# Altium schematic sheet universky-MCU.SchDoc
size A4
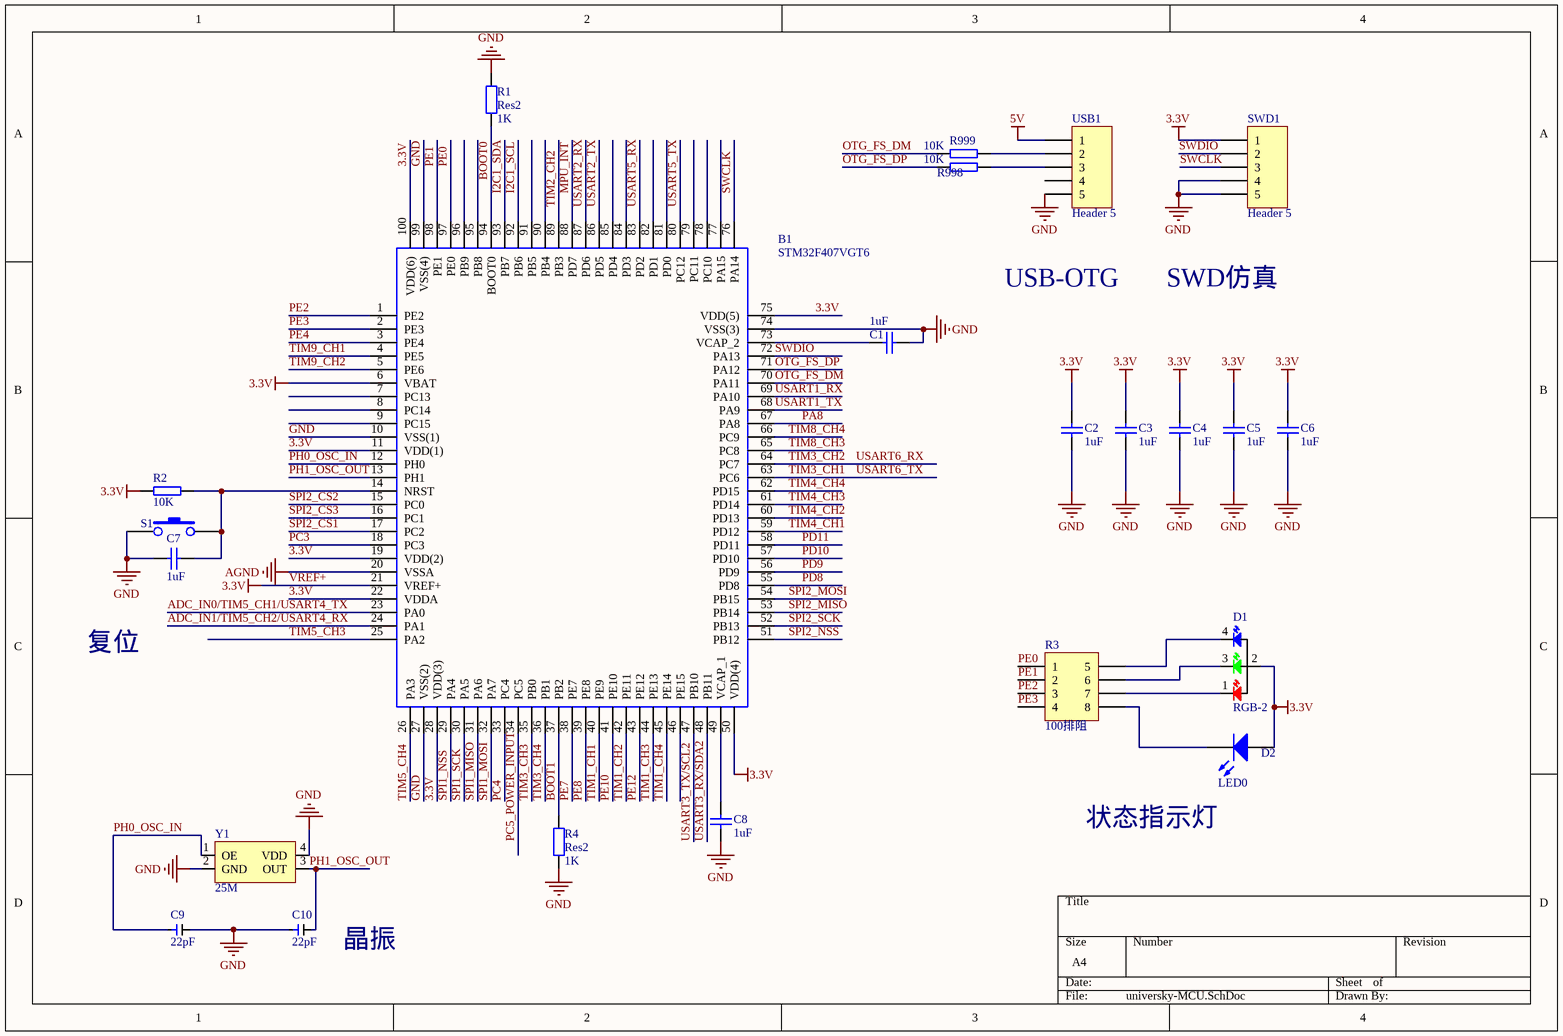
[diagram p0: universky-MCU.SchDoc]

## Parts
B1  STM32F407VGT6  [QFP50P1600X1600X160-100N]
C1  value 1uF  [0603_C]  (hidden comment: Cap)
C2  value 1uF  [0603_C]  (hidden comment: Cap)
C3  value 1uF  [0603_C]  (hidden comment: Cap)
C4  value 1uF  [0603_C]  (hidden comment: Cap)
C5  value 1uF  [0603_C]  (hidden comment: Cap)
C6  value 1uF  [0603_C]  (hidden comment: Cap)
C7  value 1uF  [0603_C]  (hidden comment: Cap)
C8  value 1uF  [0603_C]  (hidden comment: Cap)
C9  22pF  [0603_C]
C10  22pF  [0603_C]
D1  RGB-2  [RGB-2]
D2  LED0  [0603_LED]
R1  Res2  value 1K  [0603_R]
R2  RES_10K  [0603_R]  (value not drawn)
R3  100排阻  [HDR_R_4]
R4  Res2  value 1K  [0603_R]
R998  RES_10K  [0603_R]  (value not drawn)
R999  RES_10K  [0603_R]  (value not drawn)
S1  SW-PB  [KEY_SMD]  (value not drawn)
SWD1  Header 5  [USB_M]
USB1  Header 5  [USB_M]
Y1  value 25M  [XTAL_3225]  (hidden comment: XATLS)

## Nets
3.3V: B1.6(VBAT) B1.11(VDD(1)) B1.19(VDD(2)) B1.21(VREF+) B1.22(VDDA) B1.28(VDD(3)) B1.50(VDD(4)) B1.75(VDD(5)) B1.100(VDD(6)) C2.2 C3.2 C4.2 C5.2 C6.2 D1.2 D2.1(A) R2.2 SWD1.1  [also labelled VREF+]
5V: USB1.1
AGND: B1.20(VSSA)
GND: B1.10(VSS(1)) B1.27(VSS(2)) B1.74(VSS(3)) B1.99(VSS(4)) C1.2 C2.1 C3.1 C4.1 C5.1 C6.1 C7.2 C8.1 C9.2 C10.1 R1.2 R4.1 S1.1 SWD1.4 SWD1.5 USB1.5 Y1.2(GND) Y1.4(VDD)
ADC_IN0/TIM5_CH1/USART4_TX: B1.23(PA0)
ADC_IN1/TIM5_CH2/USART4_RX: B1.24(PA1)
BOOT0: B1.94(BOOT0) R1.1
BOOT1: B1.37(PB2) R4.2
I2C1_SCL: B1.92(PB6)
I2C1_SDA: B1.93(PB7)
MPU_INT: B1.88(PD7)
OTG_FS_DM: B1.70(PA11) R999.2
OTG_FS_DP: B1.71(PA12) R998.2
PA8: B1.67(PA8)
PC3: B1.18(PC3)
PC4: B1.33(PC4)
PC5_POWER_INPUT: B1.34(PC5)
PD8: B1.55(PD8)
PD9: B1.56(PD9)
PD10: B1.57(PD10)
PD11: B1.58(PD11)
PE0: B1.97(PE0) R3.1
PE1: B1.98(PE1) R3.2
PE2: B1.1(PE2) R3.3
PE3: B1.2(PE3) R3.4
PE4: B1.3(PE4)
PE7: B1.38(PE7)
PE8: B1.39(PE8)
PE10: B1.41(PE10)
PE12: B1.43(PE12)
PH0_OSC_IN: B1.12(PH0) C9.1 Y1.1(OE)
PH1_OSC_OUT: B1.13(PH1) C10.2 Y1.3(OUT)
SPI1_MISO: B1.31(PA6)
SPI1_MOSI: B1.32(PA7)
SPI1_NSS: B1.29(PA4)
SPI1_SCK: B1.30(PA5)
SPI2_CS1: B1.17(PC2)
SPI2_CS2: B1.15(PC0)
SPI2_CS3: B1.16(PC1)
SPI2_MISO: B1.53(PB14)
SPI2_MOSI: B1.54(PB15)
SPI2_NSS: B1.51(PB12)
SPI2_SCK: B1.52(PB13)
SWCLK: B1.76(PA14) SWD1.3
SWDIO: B1.72(PA13) SWD1.2
TIM1_CH1: B1.40(PE9)
TIM1_CH2: B1.42(PE11)
TIM1_CH3: B1.44(PE13)
TIM1_CH4: B1.45(PE14)
TIM2_CH2: B1.89(PB3)
TIM3_CH1: B1.63(PC6)  [also labelled USART6_TX]
TIM3_CH2: B1.64(PC7)  [also labelled USART6_RX]
TIM3_CH3: B1.35(PB0)
TIM3_CH4: B1.36(PB1)
TIM4_CH1: B1.59(PD12)
TIM4_CH2: B1.60(PD13)
TIM4_CH3: B1.61(PD14)
TIM4_CH4: B1.62(PD15)
TIM5_CH3: B1.25(PA2)
TIM5_CH4: B1.26(PA3)
TIM8_CH3: B1.65(PC8)
TIM8_CH4: B1.66(PC9)
TIM9_CH1: B1.4(PE5)
TIM9_CH2: B1.5(PE6)
USART1_RX: B1.69(PA10)
USART1_TX: B1.68(PA9)
USART2_RX: B1.87(PD6)
USART2_TX: B1.86(PD5)
USART3_RX/SDA2: B1.48(PB11)
USART3_TX/SCL2: B1.47(PB10)
USART5_RX: B1.83(PD2)
USART5_TX: B1.80(PC12)
NetB1_14: B1.14(NRST) C7.1 R2.1 S1.2
NetB1_49: B1.49(VCAP_1) C8.2
NetB1_73: B1.73(VCAP_2) C1.1
NetD1_1: D1.1(R) R3.7
NetD1_3: D1.3(G) R3.6
NetD1_4: D1.4(B) R3.5
NetD2_2: D2.2(K) R3.8
NetR998_1: R998.1 USB1.3
NetR999_1: R999.1 USB1.2

Not connected (* = marked no-connect by the designer): B1 7(PC13) 8(PC14) 9(PC15) 46(PE15) 77(PA15) 78(PC10) 79(PC11) 81(PD0) 82(PD1) 84(PD3) 85(PD4) 90(PB4) 91(PB5) 95(PB8) 96(PB9); USB1 4

## Notes on the sheet
- USB-OTG
- SWD仿真
- 复位
- 状态指示灯
- (near C10) 晶振
- (in symbol RES_10K) 10K

## Library data of the parts
B1 = STM32F407VGT6: MCU 32-Bit, ARM Cortex M4, 1MB Flash STMicroelectronics STM32F407VGT6, 32bit ARM Cortex M4F Microcontroller, 168MHz, 1024 kB Flash, 100-Pin LQFP; Allied_Number: 70391107; Geometry.Height: 1.6mm; Supplier_Name: RS; RS Part Number: 7468226; Manufacturer_Name: STMicroelectronics; Manufacturer_Part_Number: STM32F407VGT6; Other Part Number: *; Datasheet Link: http://www.st.com/web/en/resource/technical/document/datasheet/DM00037051.pdf; 3D Package: *
C1-C8 = Cap: Capacitor; Published: 8-Jun-2000; LatestRevisionDate: 17-Jul-2002; LatestRevisionNote: Re-released for DXP Platform.; PackageReference: RAD-0.3; Publisher: Altium Limited; PackageDescription: Radial Cap, Thru-Hole; 2 Leads; 0.3 in Pin Spacing
C9 C10 = CAP
D2 = LED0: Typical INFRARED GaAs LED; Published: 8-Jun-2000; LatestRevisionDate: 08-Jul-2005; LatestRevisionNote: Mech Layer 1 removed.; PackageReference: LED-0; Publisher: Altium Limited; PackageDescription: LED; 2 Leads
R1 R4 = Res2: Resistor; Published: 8-Jun-2000; LatestRevisionDate: 17-Jul-2002; LatestRevisionNote: Re-released for DXP Platform.; PackageReference: AXIAL-0.4; Publisher: Altium Limited; PackageDescription: Axial Device, Thru-Hole; 2 Leads; 0.4 in Pin Spacing
R3 = Header 4X2A: Header, 4-Pin, Dual row; LatestRevisionDate: 17-Jul-2002; LatestRevisionNote: Re-released for DXP Platform.; Publisher: Altium Limited
SWD1 USB1 = Header 5: Header, 5-Pin; LatestRevisionDate: 17-Jul-2002; LatestRevisionNote: Re-released for DXP Platform.; Publisher: Altium Limited
Y1 = XATLS: 贴片有源晶振